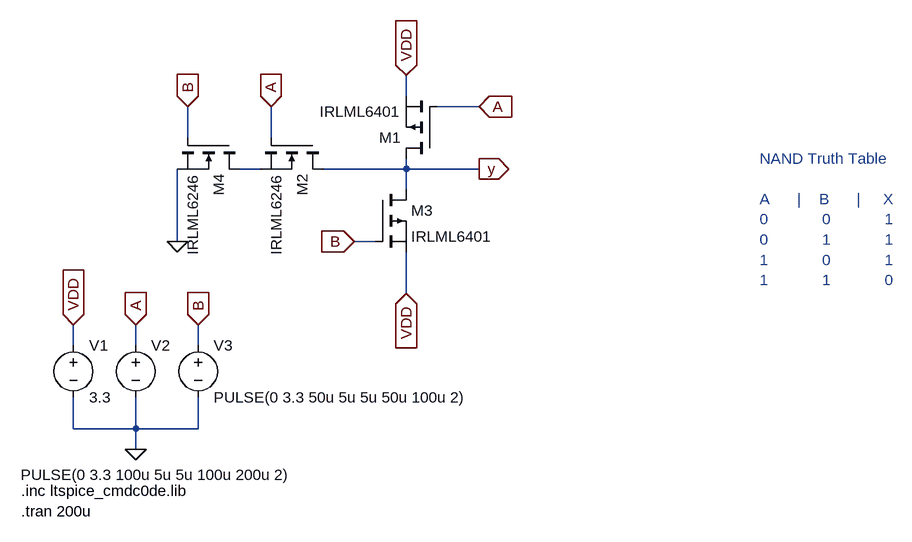
[diagram p0: schematic nand_raw.asc]
nand_raw.asc, the LTspice schematic file:
Version 4.1
SHEET 1 1260 700
WIRE 480 48 480 16
WIRE 592 64 528 64
WIRE 144 112 144 64
WIRE 272 112 272 64
WIRE 256 160 224 160
WIRE 480 160 480 144
WIRE 480 160 352 160
WIRE 592 160 480 160
WIRE 480 192 480 160
WIRE 128 272 128 160
WIRE 432 272 400 272
WIRE 480 352 480 288
WIRE -32 432 -32 400
WIRE 64 432 64 400
WIRE 160 432 160 400
WIRE -32 560 -32 512
WIRE 64 560 64 512
WIRE 64 560 -32 560
WIRE 160 560 160 512
WIRE 160 560 64 560
WIRE 64 592 64 560
FLAG 592 160 y
IOPIN 592 160 Out
FLAG 592 64 A
IOPIN 592 64 In
FLAG 400 272 B
IOPIN 400 272 In
FLAG 480 16 VDD
IOPIN 480 16 In
FLAG 480 352 VDD
IOPIN 480 352 In
FLAG 272 64 A
IOPIN 272 64 In
FLAG 144 64 B
IOPIN 144 64 In
FLAG 128 272 0
FLAG 64 592 0
FLAG -32 400 VDD
IOPIN -32 400 In
FLAG 64 400 A
IOPIN 64 400 In
FLAG 160 400 B
IOPIN 160 400 In
SYMBOL pmos 528 144 R180
SYMATTR InstName M1
SYMATTR Value IRLML6401
SYMBOL nmos 352 112 R90
SYMATTR InstName M2
SYMATTR Value IRLML6246
SYMBOL pmos 432 192 R0
SYMATTR InstName M3
SYMATTR Value IRLML6401
SYMBOL nmos 224 112 R90
SYMATTR InstName M4
SYMATTR Value IRLML6246
SYMBOL voltage -32 416 R0
WINDOW 123 0 0 Left 0
WINDOW 39 0 0 Left 0
SYMATTR InstName V1
SYMATTR Value 3.3
SYMBOL voltage 64 416 R0
WINDOW 3 -177 215 Left 2
WINDOW 123 0 0 Left 0
WINDOW 39 0 0 Left 0
SYMATTR Value PULSE(0 3.3 100u 5u 5u 100u 200u 2)
SYMATTR InstName V2
SYMBOL voltage 160 416 R0
WINDOW 123 0 0 Left 0
WINDOW 39 0 0 Left 0
SYMATTR InstName V3
SYMATTR Value PULSE(0 3.3 50u 5u 5u 50u 100u 2)
TEXT -112 656 Left 2 !.inc ltspice_cmdc0de.lib\n.tran 200u
TEXT 1024 144 Left 2 ;NAND Truth Table\n \nA      |    B      |     X\n0            0            1\n0            1            1\n1            0            1\n1            1            0

The netlist it stands for:
* nand_raw.asc
M1 y A VDD VDD IRLML6401
M2 y A N001 N001 IRLML6246
M3 y B VDD VDD IRLML6401
M4 N001 B 0 0 IRLML6246
V1 VDD 0 3.3
V2 A 0 PULSE(0 3.3 100u 5u 5u 100u 200u 2)
V3 B 0 PULSE(0 3.3 50u 5u 5u 50u 100u 2)
.model NMOS NMOS
.model PMOS PMOS
.lib standard.mos
.inc ltspice_cmdc0de.lib
.tran 200u
* NAND Truth Table
* A      |    B      |     X
* 0            0            1
* 0            1            1
* 1            0            1
* 1            1            0
.backanno
.end